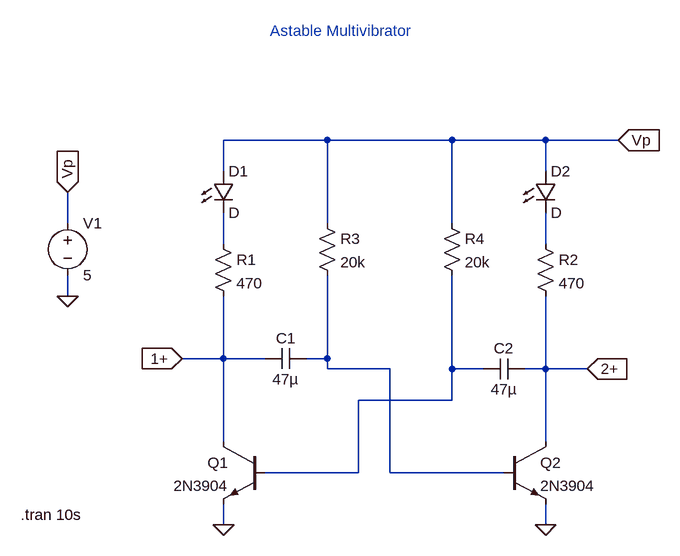
[diagram p0: schematic astable_multivib_ltspice.asc]
astable_multivib_ltspice.asc, the LTspice schematic file:
Version 4
SHEET 1 880 680
WIRE 256 -608 96 -608
WIRE 448 -608 256 -608
WIRE 592 -608 448 -608
WIRE 704 -608 592 -608
WIRE 96 -560 96 -608
WIRE 592 -560 592 -608
WIRE -144 -480 -144 -528
WIRE 256 -480 256 -608
WIRE 448 -480 448 -608
WIRE 96 -448 96 -496
WIRE 592 -448 592 -496
WIRE -144 -368 -144 -400
WIRE 96 -272 96 -368
WIRE 96 -272 32 -272
WIRE 160 -272 96 -272
WIRE 256 -272 256 -400
WIRE 256 -272 224 -272
WIRE 256 -256 256 -272
WIRE 352 -256 256 -256
WIRE 448 -256 448 -400
WIRE 496 -256 448 -256
WIRE 592 -256 592 -368
WIRE 592 -256 560 -256
WIRE 656 -256 592 -256
WIRE 448 -208 448 -256
WIRE 448 -208 304 -208
WIRE 96 -144 96 -272
WIRE 592 -144 592 -256
WIRE 304 -96 304 -208
WIRE 304 -96 160 -96
WIRE 352 -96 352 -256
WIRE 528 -96 352 -96
WIRE 96 -16 96 -48
WIRE 592 -16 592 -48
FLAG 96 -16 0
FLAG 592 -16 0
FLAG 704 -608 Vp
IOPIN 704 -608 In
FLAG 32 -272 1+
IOPIN 32 -272 In
FLAG 656 -256 2+
IOPIN 656 -256 In
FLAG -144 -368 0
FLAG -144 -528 Vp
IOPIN -144 -528 In
SYMBOL npn 160 -144 M0
SYMATTR InstName Q1
SYMATTR Value 2N3904
SYMBOL npn 528 -144 R0
SYMATTR InstName Q2
SYMATTR Value 2N3904
SYMBOL res 80 -464 R0
SYMATTR InstName R1
SYMATTR Value 470
SYMBOL res 576 -464 R0
SYMATTR InstName R2
SYMATTR Value 470
SYMBOL res 240 -496 R0
SYMATTR InstName R3
SYMATTR Value 20k
SYMBOL res 432 -496 R0
SYMATTR InstName R4
SYMATTR Value 20k
SYMBOL cap 224 -288 R90
WINDOW 0 0 32 VBottom 2
WINDOW 3 32 32 VTop 2
SYMATTR InstName C1
SYMATTR Value 47µ
SYMBOL cap 560 -272 R90
WINDOW 0 0 32 VBottom 2
WINDOW 3 32 32 VTop 2
SYMATTR InstName C2
SYMATTR Value 47µ
SYMBOL LED 80 -560 R0
SYMATTR InstName D1
SYMBOL LED 576 -560 R0
SYMATTR InstName D2
SYMBOL voltage -144 -496 R0
WINDOW 123 0 0 Left 0
WINDOW 39 0 0 Left 0
SYMATTR InstName V1
SYMATTR Value 5
TEXT -216 -32 Left 2 !.tran 10s
TEXT 168 -776 Left 2 ;Astable Multivibrator

The netlist it stands for:
* astable_multivib_ltspice.asc
Q1 1+ N004 0 0 2N3904
Q2 2+ N003 0 0 2N3904
R1 N001 1+ 470
R2 N002 2+ 470
R3 Vp N003 20k
R4 Vp N004 20k
C1 N003 1+ 47µ
C2 2+ N004 47µ
D1 Vp N001 D
D2 Vp N002 D
V1 Vp 0 5
.model D D
.lib standard.dio
.model NPN NPN
.model PNP PNP
.lib standard.bjt
.tran 10s
* Astable Multivibrator
.backanno
.end